# Altium schematic sheet ReferenceWaveyRadar.SchDoc: Reference WaveyRadar Schematic
size Letter; Author: Will Vu; CompanyName: Raccoon Wireless; DrawnBy: Will Vu, Raccoon Wireless; Engineer: Will Vu; Organization: Raccoon Wireless; DocumentNumber: 2-01; Revision: 2; SheetNumber: 1; SheetTotal: 15
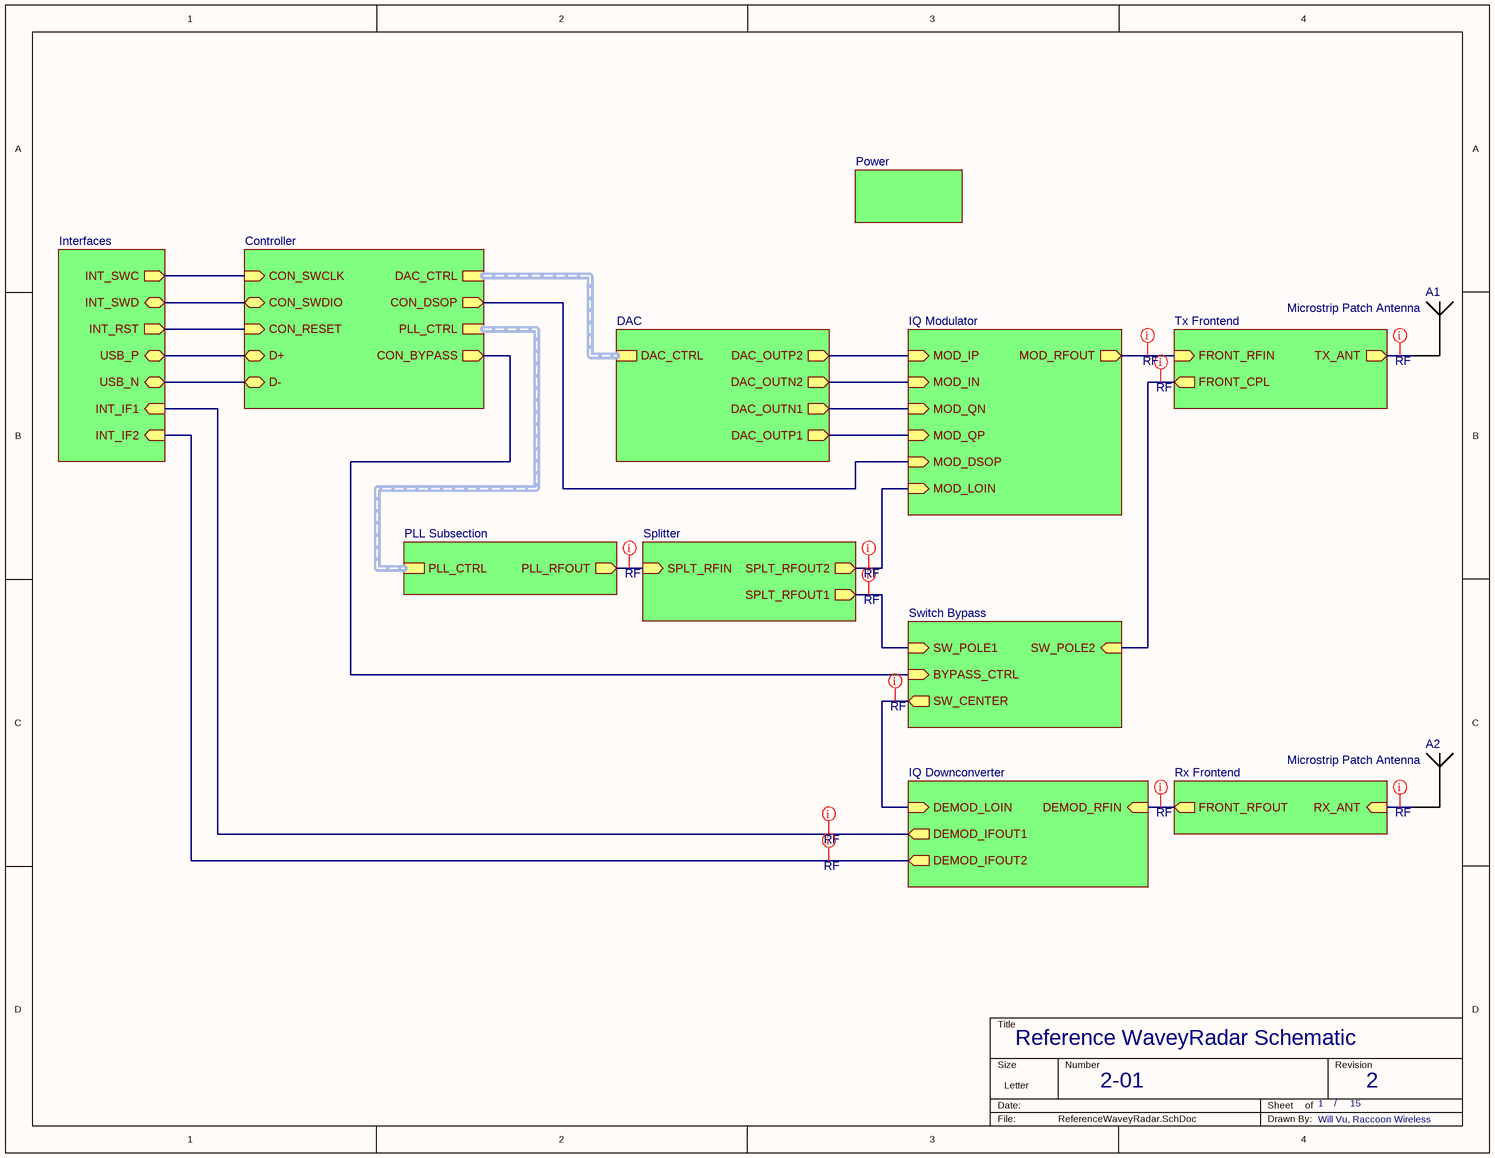
[diagram p0: ReferenceWaveyRadar.SchDoc]

## Parts
A1  Microstrip Patch Antenna  [Microstrip Patch Antenna]
A2  Microstrip Patch Antenna  [Microstrip Patch Antenna]

## Sub-sheets
Controller = ControllerWaveyRadar.SchDoc: D+ (bidir), D- (bidir), CON_SWDIO (bidir), CON_SWCLK (in), PLL_CTRL (harness PLL Control), DAC_CTRL (harness DAC Control), CON_BYPASS (out), CON_DSOP (out), CON_RESET (in)
DAC = DACWaveyRadar.SchDoc: DAC_OUTP2 (out), DAC_OUTN2 (out), DAC_OUTN1 (out), DAC_OUTP1 (out), DAC_CTRL (harness DAC Control)
Interfaces = InterfacesWaveyRadar.SchDoc: USB_N (bidir), USB_P (bidir), INT_SWD (bidir), INT_SWC (out), INT_RST (out), INT_IF1 (in), INT_IF2 (in)
IQ Downconverter = IQDownconverterWaveyRadar.SchDoc: DEMOD_RFIN (in), DEMOD_IFOUT1 (out), DEMOD_IFOUT2 (out), DEMOD_LOIN (in)
IQ Modulator = IQModulatorWaveyRadar.SchDoc: MOD_LOIN (in), MOD_RFOUT (out), MOD_IP (in), MOD_IN (in), MOD_QN (in), MOD_QP (in), MOD_DSOP (in)
PLL Subsection = PLLSubsectionWaveyRadar.SchDoc: PLL_CTRL (harness PLL Control), PLL_RFOUT (out)
Power = PowerWaveyRadar.SchDoc: no entries
Rx Frontend = RxFrontendWaveyRadar.SchDoc: FRONT_RFOUT (out), RX_ANT (in)
Splitter = SplitterWaveyRadar.SchDoc: SPLT_RFIN (in), SPLT_RFOUT2 (out), SPLT_RFOUT1 (out)
Switch Bypass = SwitchBypassWaveyRadar.SchDoc: SW_POLE1 (in), SW_CENTER (out), SW_POLE2 (in), BYPASS_CTRL (in)
Tx Frontend = TxFrontendWaveyRadar.SchDoc: FRONT_RFIN (in), FRONT_CPL (out), TX_ANT (out)

## Nets
NetA1_1: A1.1(RFIN) ; sheet Tx Frontend/TX_ANT
NetA2_1: A2.1(RFIN) ; sheet Rx Frontend/RX_ANT
(unnamed): sheet Controller/D+, sheet Interfaces/USB_P
(unnamed): sheet Controller/D-, sheet Interfaces/USB_N
(unnamed): sheet Controller/CON_SWDIO, sheet Interfaces/INT_SWD
(unnamed): sheet Controller/CON_SWCLK, sheet Interfaces/INT_SWC
(unnamed): sheet Controller/CON_BYPASS, sheet Switch Bypass/BYPASS_CTRL
(unnamed): sheet Controller/CON_DSOP, sheet IQ Modulator/MOD_DSOP
(unnamed): sheet Controller/CON_RESET, sheet Interfaces/INT_RST
(unnamed): sheet DAC/DAC_OUTP2, sheet IQ Modulator/MOD_IP
(unnamed): sheet DAC/DAC_OUTN2, sheet IQ Modulator/MOD_IN
(unnamed): sheet DAC/DAC_OUTN1, sheet IQ Modulator/MOD_QN
(unnamed): sheet DAC/DAC_OUTP1, sheet IQ Modulator/MOD_QP
(unnamed): sheet IQ Downconverter/DEMOD_RFIN, sheet Rx Frontend/FRONT_RFOUT
(unnamed): sheet IQ Downconverter/DEMOD_IFOUT1, sheet Interfaces/INT_IF1
(unnamed): sheet IQ Downconverter/DEMOD_IFOUT2, sheet Interfaces/INT_IF2
(unnamed): sheet IQ Downconverter/DEMOD_LOIN, sheet Switch Bypass/SW_CENTER
(unnamed): sheet IQ Modulator/MOD_LOIN, sheet Splitter/SPLT_RFOUT2
(unnamed): sheet IQ Modulator/MOD_RFOUT, sheet Tx Frontend/FRONT_RFIN
(unnamed): sheet PLL Subsection/PLL_RFOUT, sheet Splitter/SPLT_RFIN
(unnamed): sheet Splitter/SPLT_RFOUT1, sheet Switch Bypass/SW_POLE1
(unnamed): sheet Switch Bypass/SW_POLE2, sheet Tx Frontend/FRONT_CPL

## Buses and harness runs
harness sheet Controller/DAC_CTRL = sheet DAC/DAC_CTRL
harness sheet Controller/PLL_CTRL = sheet PLL Subsection/PLL_CTRL

## Layout directives
net class RF: (no net found under the mark), NetA1_1, NetA2_1

## Notes on the sheet
- /

## Library data of the parts
A1 A2 = CMP-00025-00007-16: PCB Patch Antenna